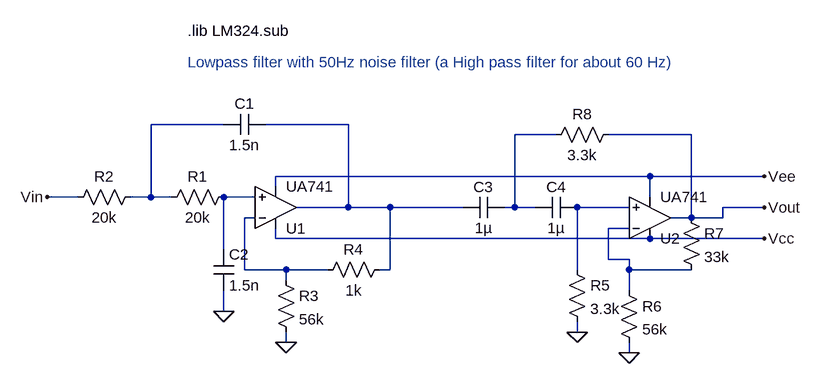
[diagram p0: schematic LowPass.asc]
LowPass.asc, the LTspice schematic file:
Version 4
SHEET 1 1116 680
WIRE 128 32 16 32
WIRE 320 32 192 32
WIRE 640 48 576 48
WIRE 848 48 720 48
WIRE 784 112 208 112
WIRE 960 112 784 112
WIRE 208 128 208 112
WIRE -96 144 -144 144
WIRE 16 144 16 32
WIRE 16 144 -16 144
WIRE 48 144 16 144
WIRE 176 144 128 144
WIRE 784 144 784 112
WIRE 320 160 320 32
WIRE 320 160 240 160
WIRE 384 160 320 160
WIRE 496 160 384 160
WIRE 576 160 576 48
WIRE 576 160 560 160
WIRE 608 160 576 160
WIRE 752 160 672 160
WIRE 960 160 896 160
WIRE 176 176 160 176
WIRE 848 176 848 48
WIRE 848 176 816 176
WIRE 896 176 896 160
WIRE 896 176 848 176
WIRE 752 192 720 192
WIRE 208 208 208 192
WIRE 784 208 208 208
WIRE 960 208 784 208
WIRE 128 224 128 144
WIRE 720 240 720 192
WIRE 752 240 720 240
WIRE 160 256 160 176
WIRE 224 256 160 256
WIRE 288 256 224 256
WIRE 384 256 384 160
WIRE 384 256 368 256
WIRE 672 256 672 160
WIRE 752 256 752 240
WIRE 848 256 752 256
WIRE 224 272 224 256
WIRE 752 288 752 256
WIRE 128 320 128 288
WIRE 672 352 672 336
WIRE 224 368 224 352
WIRE 752 384 752 368
FLAG 128 320 0
FLAG 224 368 0
FLAG 960 208 Vcc
FLAG 960 112 Vee
FLAG 960 160 Vout
FLAG -144 144 Vin
FLAG 672 352 0
FLAG 752 384 0
SYMBOL res 144 128 R90
WINDOW 0 0 56 VBottom 2
WINDOW 3 32 56 VTop 2
SYMATTR InstName R1
SYMATTR Value 20k
SYMBOL res 0 128 R90
WINDOW 0 0 56 VBottom 2
WINDOW 3 32 56 VTop 2
SYMATTR InstName R2
SYMATTR Value 20k
SYMBOL cap 192 16 R90
WINDOW 0 0 32 VBottom 2
WINDOW 3 32 32 VTop 2
SYMATTR InstName C1
SYMATTR Value 1.5n
SYMBOL cap 112 224 R0
SYMATTR InstName C2
SYMATTR Value 1.5n
SYMBOL res 208 256 R0
SYMATTR InstName R3
SYMATTR Value 56k
SYMBOL res 384 240 R90
WINDOW 0 0 56 VBottom 2
WINDOW 3 32 56 VTop 2
SYMATTR InstName R4
SYMATTR Value 1k
SYMBOL cap 560 144 R90
WINDOW 0 0 32 VBottom 2
WINDOW 3 32 32 VTop 2
SYMATTR InstName C3
SYMATTR Value 1µ
SYMBOL cap 672 144 R90
WINDOW 0 0 32 VBottom 2
WINDOW 3 32 32 VTop 2
SYMATTR InstName C4
SYMATTR Value 1µ
SYMBOL res 656 240 R0
SYMATTR InstName R5
SYMATTR Value 3.3k
SYMBOL res 736 272 R0
SYMATTR InstName R6
SYMATTR Value 56k
SYMBOL res 832 160 R0
SYMATTR InstName R7
SYMATTR Value 33k
SYMBOL res 736 32 R90
WINDOW 0 0 56 VBottom 2
WINDOW 3 32 56 VTop 2
SYMATTR InstName R8
SYMATTR Value 3.3k
SYMBOL Opamps\\LM324 208 224 M180
SYMATTR InstName U1
SYMATTR Value UA741
SYMBOL Opamps\\LM324 784 240 M180
SYMATTR InstName U2
SYMATTR Value UA741
TEXT 72 -64 Left 2 ;Lowpass filter with 50Hz noise filter (a High pass filter for about 60 Hz)
TEXT 72 -112 Left 2 !.lib LM324.sub

The netlist it stands for:
* LowPass.asc
R1 N004 N001 20k
R2 N001 Vin 20k
C1 N002 N001 1.5n
C2 N004 0 1.5n
R3 N006 0 56k
R4 N002 N006 1k
C3 N003 N002 1µ
C4 N005 N003 1µ
R5 N005 0 3.3k
R6 N007 0 56k
R7 Vout N007 33k
R8 Vout N003 3.3k
XU1 N004 N006 Vcc Vee N002 UA741  ; pins In+ In- V+ V- OUT
XU2 N005 N007 Vcc Vee Vout UA741  ; pins In+ In- V+ V- OUT
* Lowpass filter with 50Hz noise filter (a High pass filter for about 60 Hz)
.lib LM324.sub
.backanno
.end